# Altium schematic sheet A.SchDoc
size A
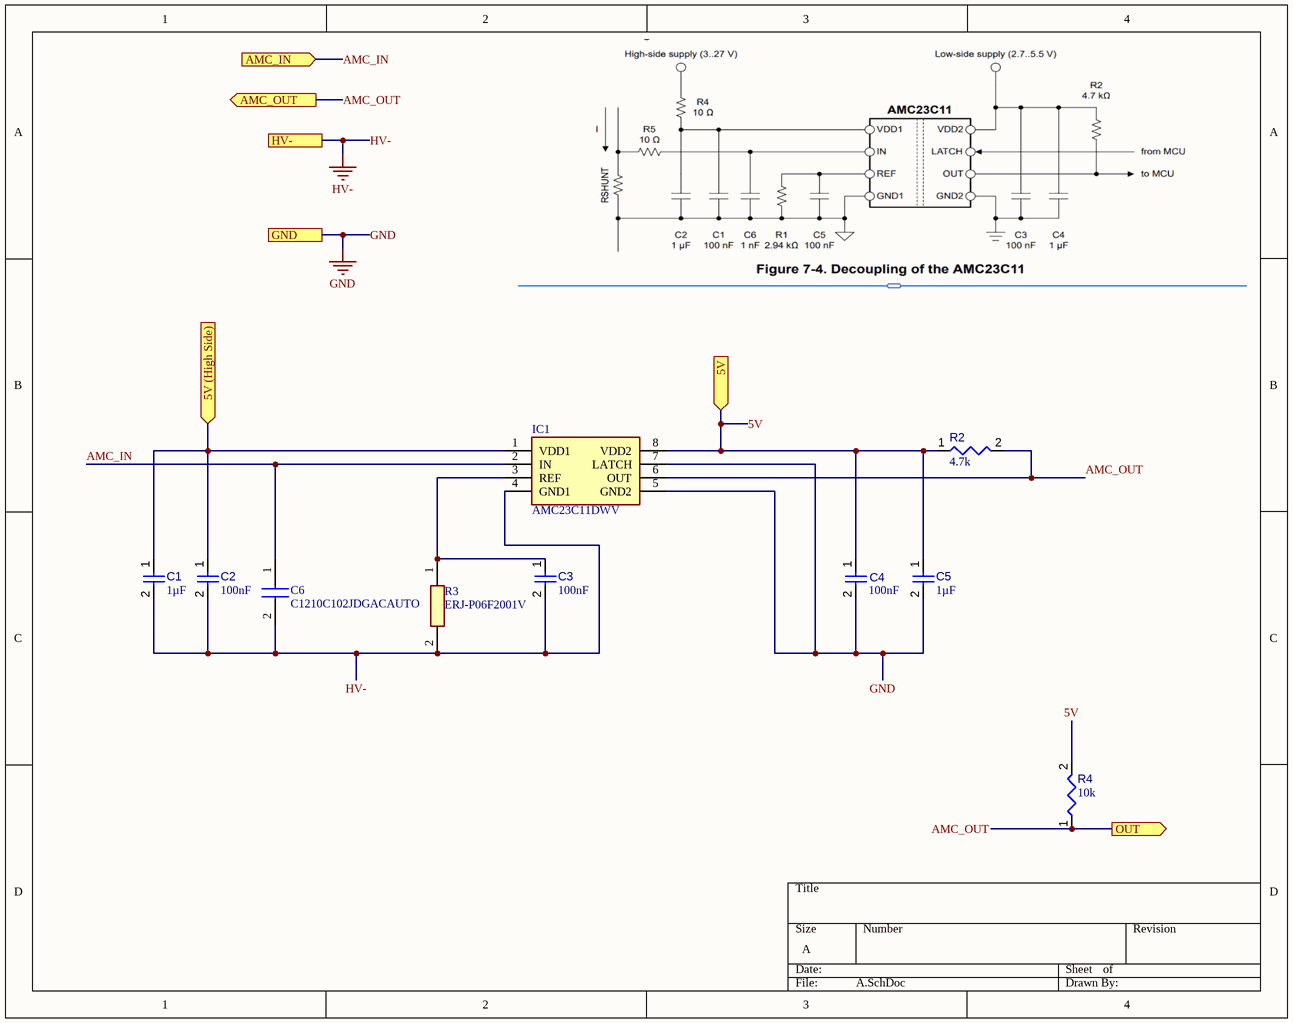
[diagram p0: A.SchDoc]

## Parts
C1  value 1µF  [CAPC2013X135X45NL10T25]  (hidden comment: Capacitor 1 uF +/- 10% 50 V 0805)
C2  value 100nF  [CAPC2013X95X50LL10T25]  (hidden comment: Capacitor 100 nF +/-10% 50 V 0805)
C3  value 100nF  [CAPC2013X95X50LL10T25]  (hidden comment: Capacitor 100 nF +/-10% 50 V 0805)
C4  value 100nF  [CAPC2013X95X50LL10T25]  (hidden comment: Capacitor 100 nF +/-10% 50 V 0805)
C5  value 1µF  [CAPC2013X135X45NL10T25]  (hidden comment: Capacitor 1 uF +/- 10% 50 V 0805)
C6  C1210C102JDGACAUTO  [C1210]
IC1  AMC23C11DWV  [SOIC127P1150X280-8N]
R2  value 4.7k  [RESC2013X70X40ML20T20]  (hidden comment: Resistor 4k7 +/-1% 0805 125 mW)
R3  ERJ-P06F2001V  [ERJP06D1000V]
R4  value 10k  [RESC2013X50X35ML15T15]  (hidden comment: Resistor 10k +/-1% 0805 125 mW)

## Ports
5V (High Side) (in), 5V (in), AMC_IN (in), AMC_OUT (out), GND, HV-, OUT (out)

## Nets
GND: C4.2 C5.2 IC1.5(GND2) IC1.7(LATCH) ; port GND
HV-: C1.2 C2.2 C3.2 C6.2 IC1.4(GND1) R3.2 ; port HV-
5V: C4.1 C5.1 IC1.8(VDD2) R2.1 R4.2 ; port 5V
5V (High Side): C1.1 C2.1 IC1.1(VDD1) ; port 5V (High Side)
AMC_IN: C6.1 IC1.2(IN) ; port AMC_IN
AMC_OUT: IC1.6(OUT) R2.2 R4.1 ; port AMC_OUT, port OUT
NetC3_1: C3.1 IC1.3(REF) R3.1

## Library data of the parts
C1 C5 = CMP-001-00007-6: Chip Capacitor, 1 uF, +/- 10%, 50 V, 0805 (2012 Metric); Capacitor Type: Ceramic; Voltage Rating: 50V; Min Operating Temperature: -55°C; RoHS Compliant: True; Mounting Technology: SM; Case/Package: 0805; Max Operating Temperature: 125°C; Tolerance: 10%; Pins: 2
C2-C4 = CMP-001-00018-6: Chip Capacitor, 100 nF, +/- 10%, 50 V, 0805 (2012 Metric); Capacitor Type: Ceramic; Voltage Rating: 50V; Pins: 2; Max Operating Temperature: 125°C; Min Operating Temperature: -55°C; Mounting Technology: SM; Case/Package: 0805; RoHS Compliant: True; Tolerance: 10%
C6 = C1210C102JDGACAUTO: Capacitor; Manufacturer_Name: Yageo Group; Datasheet Link: https://www.yageogroup.com/content/datasheet/asset/file/KEM_C1080_C0G_HV_AUTO_SMD; Manufacturer_Part_Number: C1210C102JDGACAUTO; Mouser Part Number: 80-C1210C102JDGAUTO; Mouser Price/Stock: https://www.mouser.co.uk/ProductDetail/KEMET/C1210C102JDGACAUTO?qs=f9yNj16SXrIz1%252BjZlRLS%2FQ%3D%3D
IC1 = AMC23C11DWV: Integrated Circuit; Manufacturer_Name: Texas Instruments; Datasheet Link: https://www.ti.com/lit/ds/symlink/amc23c11.pdf; Height: 2.8mm; Manufacturer_Part_Number: AMC23C11DWV; Mouser Part Number: 595-AMC23C11DWV; Mouser Price/Stock: https://www.mouser.co.uk/ProductDetail/Texas-Instruments/AMC23C11DWV?qs=By6Nw2ByBD0b%2FD7l%2FEQWqQ%3D%3D; Arrow Part Number: AMC23C11DWV; Arrow Price/Stock: https://www.arrow.com/en/products/amc23c11dwv/texas-instruments?utm_currency=USD&region=nac
R2 = CMP-009-00032-5: Chip Resistor, 4.7 KOhm, +/- 1%, 0.125 W, -55 to 155 degC, 0805 (2012 Metric); Power: 125mW; Voltage Rating: 150V; Max Operating Temperature: 155°C; Min Operating Temperature: -55°C; Case/Package: 0805; RoHS Compliant: True; Pins: 2; Tolerance: 1%; Mounting Technology: SM
R3 = ERJ-P06F2001V: Resistor; Manufacturer_Name: Panasonic; Datasheet Link: http://industrial.panasonic.com/cdbs/www-data/pdf/RDA0000/AOA0000C102.pdf; Height: 0.7mm; Manufacturer_Part_Number: ERJ-P06F2001V; Mouser Part Number: 667-ERJ-P06F2001V; Mouser Price/Stock: https://www.mouser.co.uk/ProductDetail/Panasonic/ERJ-P06F2001V?qs=iIVTEDlrHA33HmjCRTb3vw%3D%3D; Arrow Part Number: ERJ-P06F2001V; Arrow Price/Stock: https://www.arrow.com/en/products/erjp06f2001v/panasonic?region=nac
R4 = CMP-009-00018-5: Chip Resistor, 10 KOhm, +/- 1%, 125 mW, -55 to 155 degC, 0805 (2012 Metric); Power: 125mW; Voltage Rating: 150V; Tolerance: 1%; Pins: 2; Min Operating Temperature: -55°C; Case/Package: 0805; Max Operating Temperature: 155°C; RoHS Compliant: True; Mounting Technology: SM